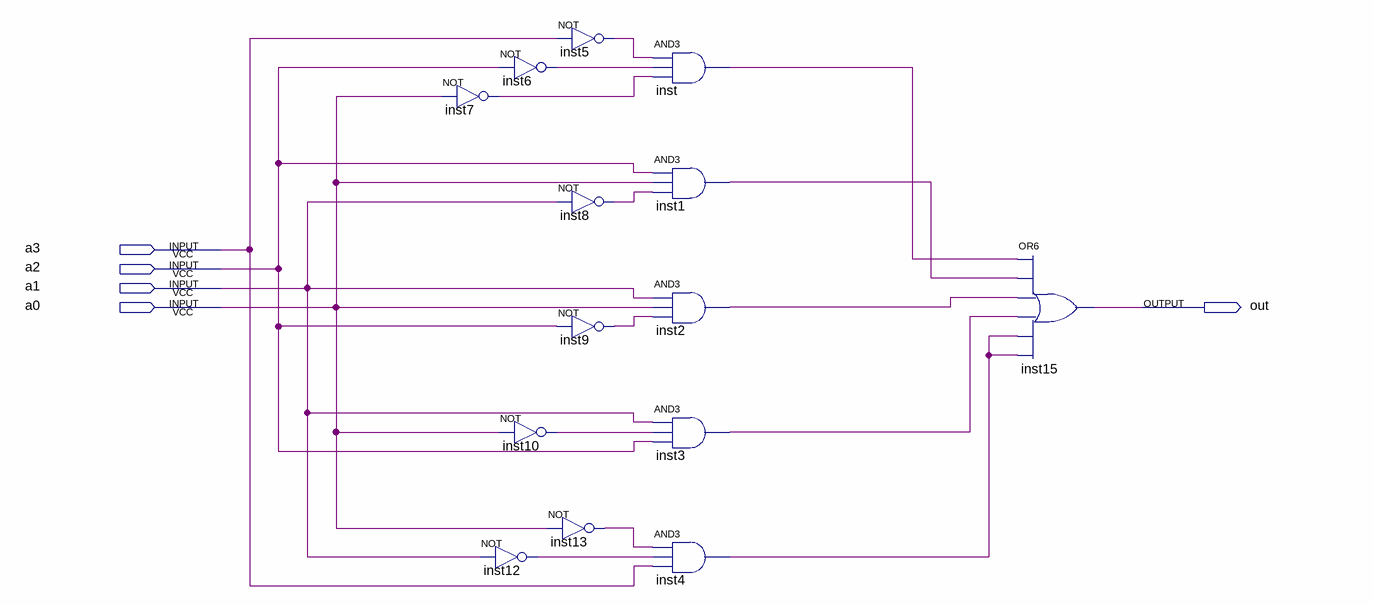
[diagram p0: schematic sheet]
// Quartus schematic FuncD.bdf as structural Verilog: 14 symbols, 5 pins
module FuncD (
  input  a3,
  input  a2,
  input  a1,
  input  a0,
  output out
);

  wire inst1_out, inst2_out, inst3_out, inst4_out, inst5_out, inst6_out, inst7_out, inst8_out, inst9_out,
       inst10_out, inst12_out, inst13_out, inst_out;

  not inst7 (inst7_out, a0);
  not inst12 (inst12_out, a1);
  not inst5 (inst5_out, a3);
  not inst6 (inst6_out, a2);
  not inst8 (inst8_out, a1);
  not inst9 (inst9_out, a2);
  not inst10 (inst10_out, a0);
  not inst13 (inst13_out, a0);
  and inst (inst_out, inst5_out, inst6_out, inst7_out);
  and inst1 (inst1_out, a2, a0, inst8_out);
  and inst2 (inst2_out, a1, a0, inst9_out);
  and inst3 (inst3_out, a1, inst10_out, a2);
  and inst4 (inst4_out, inst13_out, inst12_out, a3);
  or inst15 (out, inst_out, inst1_out, inst2_out, inst3_out, inst4_out, inst4_out);
endmodule
